# EAGLE design sbc6502 (EAGLE 6.5.0)
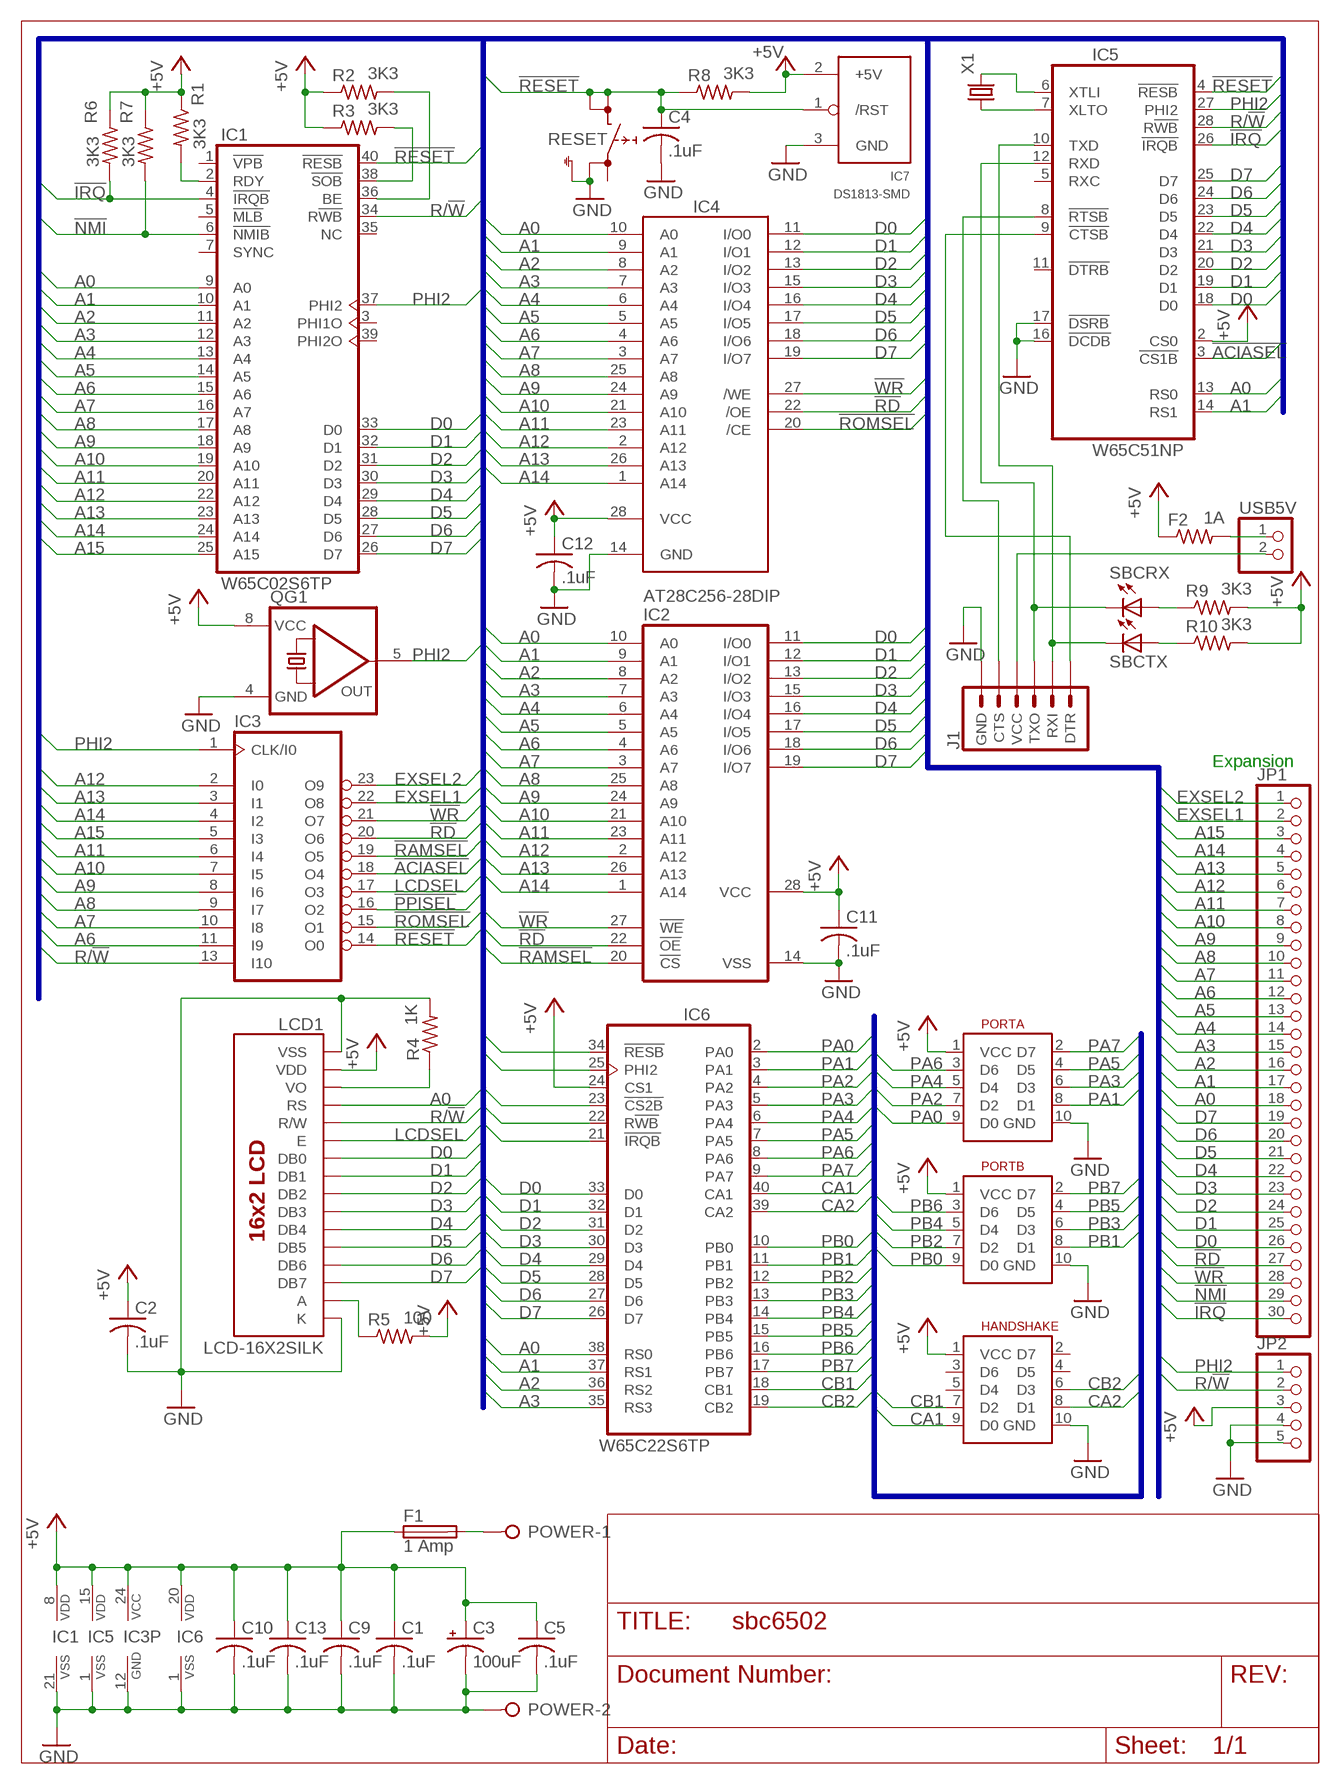
[diagram p0: schematic, sheet 1]

## Parts
C1  .1uF  C-USC0603K  [C0603K]
C2  .1uF  C-USC0603K  [C0603K]
C3  100uF  CPOL-USE5-8.5  [E5-8,5]
C4  .1uF  C-USC0603K  [C0603K]
C5  .1uF  C-USC0603K  [C0603K]
C9  .1uF  C-USC0603K  [C0603K]
C10  .1uF  C-USC0603K  [C0603K]
C11  .1uF  C-USC0603K  [C0603K]
C12  .1uF  C-USC0603K  [C0603K]
C13  .1uF  C-USC0603K  [C0603K]
F1  1 Amp  SH25  [SH25]
F2  1A  R-US_R0603  [R0603]
HANDSHAKE  8BIT_HEADER_SHROUDED  [2X05_SHROUDED]
IC1  W65C02S6TP  [DIL40]
IC2  62256P  [DIL28-6]
IC3  22V10  [DIL24-3]
IC4  AT28C256-28DIP  [DIL28-6]
IC5  W65C51NP  [DIL28-6]
IC6  W65C22S6TP  [DIL40]
IC7  DS1813-SMD  [SOT-23]
J1  6_PIN_SERIAL_TARGET  [1X06]
JP1  PINHD-1X30  [1X30]
JP2  PINHD-1X5  [1X05]
LCD1  LCD-16X2SILK  [LCD-16X2]
PORTA  8BIT_HEADER_SHROUDED  [2X05_SHROUDED]
PORTB  8BIT_HEADER_SHROUDED  [2X05_SHROUDED]
POWER  W237-02P  [W237-132]
QG1  QG5460  [DIL08S]
R1  3K3  R-US_R0603  [R0603]
R2  3K3  R-US_R0603  [R0603]
R3  3K3  R-US_R0603  [R0603]
R4  1K  R-US_R0603  [R0603]
R5  100  R-US_R0805  [R0805]
R6  3K3  R-US_R0603  [R0603]
R7  3K3  R-US_R0603  [R0603]
R8  3K3  R-US_R0603  [R0603]
R9  3K3  R-US_R0603  [R0603]
R10  3K3  R-US_R0603  [R0603]
RESET  SKHMPSE010  [SKHMPXE010]
SBCRX  LEDCHIPLED_0805  [CHIPLED_0805]
SBCTX  LEDCHIPLED_0805  [CHIPLED_0805]
USB5V  PINHD-1X2  [1X02]
X1  CRYSTALHC49U-V  [HC49U-V]

## Nets
!ACIASEL: IC3.18(O4) IC5.3(!CS1B)
!IRQ: IC1.4(1:!IRQB) IC5.26(!IRQB) IC6.21(VIA:!IRQB) JP1.30 R6.2
!NMI: IC1.6(1:!NMIB) JP1.29 R7.2
!PPISEL: IC3.16(O2) IC6.23(VIA:!CS2B)
!RAMSEL: IC2.20(!CS) IC3.19(O5)
!RD: IC2.22(!OE) IC3.20(O6) IC4.22(/OE) JP1.27
!RESET: C4.1 IC1.40(1:!RESB) IC3.14(O0) IC5.4(!RESB) IC6.34(VIA:!RESB) IC7.1(/RST) R8.1 RESET.3(2.1) RESET.4(2.2)
!ROMSEL: IC3.15(O1) IC4.20(/CE)
!WR: IC2.27(!WE) IC3.21(O7) IC4.27(/WE) JP1.28
+5V: C1.1 C2.1 C3.+ C5.1 C9.1 C10.1 C11.1 C12.1 C13.1 F1.1 F2.1 HANDSHAKE.1(VCC) IC1.8(P:VDD) IC2.28(VCC) IC3.24(VCC) IC4.28(VCC) IC5.2(CS0) IC5.15(VDD) IC6.20(VIAP:VDD) IC6.24(VIA:CS1) IC7.2(+5V) JP2.3 LCD1.2(VDD) PORTA.1(VCC) PORTB.1(VCC) QG1.8(VCC) R1.1 R2.1 R3.1 R5.2 R6.1 R7.1 R8.2 R9.2 R10.2
A0: IC1.9(1:A0) IC2.10(A0) IC4.10(A0) IC5.13(RS0) IC6.38(VIA:RS0) JP1.18 LCD1.4(RS)
A1: IC1.10(1:A1) IC2.9(A1) IC4.9(A1) IC5.14(RS1) IC6.37(VIA:RS1) JP1.17
A2: IC1.11(1:A2) IC2.8(A2) IC4.8(A2) IC6.36(VIA:RS2) JP1.16
A3: IC1.12(1:A3) IC2.7(A3) IC4.7(A3) IC6.35(VIA:RS3) JP1.15
A4: IC1.13(1:A4) IC2.6(A4) IC4.6(A4) JP1.14
A5: IC1.14(1:A5) IC2.5(A5) IC4.5(A5) JP1.13
A6: IC1.15(1:A6) IC2.4(A6) IC3.11(I9) IC4.4(A6) JP1.12
A7: IC1.16(1:A7) IC2.3(A7) IC3.10(I8) IC4.3(A7) JP1.11
A8: IC1.17(1:A8) IC2.25(A8) IC3.9(I7) IC4.25(A8) JP1.10
A9: IC1.18(1:A9) IC2.24(A9) IC3.8(I6) IC4.24(A9) JP1.9
A10: IC1.19(1:A10) IC2.21(A10) IC3.7(I5) IC4.21(A10) JP1.8
A11: IC1.20(1:A11) IC2.23(A11) IC3.6(I4) IC4.23(A11) JP1.7
A12: IC1.22(1:A12) IC2.2(A12) IC3.2(I0) IC4.2(A12) JP1.6
A13: IC1.23(1:A13) IC2.26(A13) IC3.3(I1) IC4.26(A13) JP1.5
A14: IC1.24(1:A14) IC2.1(A14) IC3.4(I2) IC4.1(A14) JP1.4
A15: IC1.25(1:A15) IC3.5(I3) JP1.3
CA1: HANDSHAKE.9(D0) IC6.40(VIA:CA1)
CA2: HANDSHAKE.8(D1) IC6.39(VIA:CA2)
CB1: HANDSHAKE.7(D2) IC6.18(VIA:CB1)
CB2: HANDSHAKE.6(D3) IC6.19(VIA:CB2)
D0: IC1.33(1:D0) IC2.11(I/O0) IC4.11(I/O0) IC5.18(D0) IC6.33(VIA:D0) JP1.26 LCD1.7(DB0)
D1: IC1.32(1:D1) IC2.12(I/O1) IC4.12(I/O1) IC5.19(D1) IC6.32(VIA:D1) JP1.25 LCD1.8(DB1)
D2: IC1.31(1:D2) IC2.13(I/O2) IC4.13(I/O2) IC5.20(D2) IC6.31(VIA:D2) JP1.24 LCD1.9(DB2)
D3: IC1.30(1:D3) IC2.15(I/O3) IC4.15(I/O3) IC5.21(D3) IC6.30(VIA:D3) JP1.23 LCD1.10(DB3)
D4: IC1.29(1:D4) IC2.16(I/O4) IC4.16(I/O4) IC5.22(D4) IC6.29(VIA:D4) JP1.22 LCD1.11(DB4)
D5: IC1.28(1:D5) IC2.17(I/O5) IC4.17(I/O5) IC5.23(D5) IC6.28(VIA:D5) JP1.21 LCD1.12(DB5)
D6: IC1.27(1:D6) IC2.18(I/O6) IC4.18(I/O6) IC5.24(D6) IC6.27(VIA:D6) JP1.20 LCD1.13(DB6)
D7: IC1.26(1:D7) IC2.19(I/O7) IC4.19(I/O7) IC5.25(D7) IC6.26(VIA:D7) JP1.19 LCD1.14(DB7)
EXSEL1: IC3.22(O8) JP1.2
EXSEL2: IC3.23(O9) JP1.1
GND: C1.2 C2.2 C3.- C4.2 C5.2 C9.2 C10.2 C11.2 C12.2 C13.2 HANDSHAKE.10(GND) IC1.21(P:VSS) IC2.14(VSS) IC3.12(GND) IC4.14(GND) IC5.1(VSS) IC5.16(!DCDB) IC5.17(!DSRB) IC6.1(VIAP:VSS) IC7.3(GND) J1.6(GND) JP2.4 JP2.5 LCD1.1(VSS) LCD1.16(K) PORTA.10(GND) PORTB.10(GND) POWER.2 QG1.4(GND) R4.2 RESET.2(1.2) RESET.5(SH)
LCDSEL: IC3.17(O3) LCD1.6(E)
N$1: LCD1.15(A) R5.1
N$2: LCD1.3(VO) R4.1
N$3: R9.1 SBCRX.A
N$4: R10.1 SBCTX.A
N$5: IC1.2(1:RDY) R1.2
N$6: IC1.38(1:!SOB) R3.2
N$7: IC1.36(1:BE) R2.2
N$11: IC5.7(XLTO) X1.1
N$12: IC5.6(XTLI) X1.2
N$15: J1.4(VCC) USB5V.2
N$16: F1.2 POWER.1
N$17: F2.2 USB5V.1
PA0: IC6.2(VIA:PA0) PORTA.9(D0)
PA1: IC6.3(VIA:PA1) PORTA.8(D1)
PA2: IC6.4(VIA:PA2) PORTA.7(D2)
PA3: IC6.5(VIA:PA3) PORTA.6(D3)
PA4: IC6.6(VIA:PA4) PORTA.5(D4)
PA5: IC6.7(VIA:PA5) PORTA.4(D5)
PA6: IC6.8(VIA:PA6) PORTA.3(D6)
PA7: IC6.9(VIA:PA7) PORTA.2(D7)
PB0: IC6.10(VIA:PB0) PORTB.9(D0)
PB1: IC6.11(VIA:PB1) PORTB.8(D1)
PB2: IC6.12(VIA:PB2) PORTB.7(D2)
PB3: IC6.13(VIA:PB3) PORTB.6(D3)
PB4: IC6.14(VIA:PB4) PORTB.5(D4)
PB5: IC6.15(VIA:PB5) PORTB.4(D5)
PB6: IC6.16(VIA:PB6) PORTB.3(D6)
PB7: IC6.17(VIA:PB7) PORTB.2(D7)
PHI2: IC1.37(1:PHI2) IC3.1(CLK/I0) IC5.27(PHI2) IC6.25(VIA:PHI2) JP2.1 QG1.5(OUT)
R/!W!: IC1.34(1:R!WB) IC3.13(I10) IC5.28(R!WB) IC6.22(VIA:R!WB) JP2.2 LCD1.5(R/W)
SBC_CTS: IC5.9(!CTSB) J1.1(DTR)
SBC_RTS: IC5.8(!RTSB) J1.5(CTS)
SBC_TX: IC5.10(TXD) J1.2(RXI) SBCTX.C
SBCRX: IC5.12(RXD) J1.3(TXO) SBCRX.C
Unconnected: HANDSHAKE.2(D7) HANDSHAKE.3(D6) HANDSHAKE.4(D5) HANDSHAKE.5(D4) IC1.1(1:!VPB) IC1.3(1:PHI1O) IC1.5(1:!MLB) IC1.7(1:SYNC) IC1.35(1:NC) IC1.39(1:PHI2O) IC5.5(RXC) IC5.11(!DTRB) RESET.1(1.1)

## Buses
BUS:D[0..7],A[0..15],PHI2,R/!W!,!RESET,!RAMSEL,!ROMSEL,!ACIASEL,!PPISEL,!IRQ,!NMI,!RD,!WR,LCDSEL,EXSEL1,EXSEL2
PPIBUS:PA[0..7],PB[0..7],CA1,CA2,CB1,CB2

## Notes on the sheet
- Expansion

## Library data of the parts
C1 C2 C4 C5 C9-C13 = rcl:C-US: CAPACITOR, American symbol
C3 = rcl:CPOL-US: POLARIZED CAPACITOR, American symbol
F1 = fuse:SH25: FUSE HOLDER grid 25 mm, OGN0031 8211, Schurter (Buerklin); MF: SCHURTER; MPN: 0031.8211; OC_FARNELL: 1162741; OC_NEWARK: 96B9380
F2 R1-R10 = rcl:R-US_: RESISTOR, American symbol
HANDSHAKE PORTA PORTB = LEDdynamics:8BIT_HEADER
IC1 = 6502:W65C02S: W65C02 by WDC
IC2 = memory-hitachi:62256P: MEMORY; OC_FARNELL: unknown; OC_NEWARK: unknown
IC3 = pal:22V10: PAL; MPN: GAL22V10D-7LPN; OC_FARNELL: 1571925; OC_NEWARK: 97M0480
IC4 = atmel-custom:AT28C256-28DIP: IC EEPROM 256KBIT 150NS 28DIP
IC5 = 6502:W65C51N: W65C51N by WDC
IC6 = 6502:W65C22S: W65C22 by WDC
IC7 = ds1813_revised:DS1813
J1 = SparkFun-Connectors:6_PIN_SERIAL_TARGET: 6-pin header connection for use with the "FTDI BASIC" pinout - TARGET SIDE. Also known as "Arduino Serial Program Header". It is used to mate with our FTDI Basic serial programmers using the Arduino IDE. Note, this device has "TARGET" in the name. It is intended to be used on a design that contains a target micro-controller that you wish to program. The "sister" device, named "CABLE" is inteneded to be used on a design that usually lives on the end of your USB cable and prvides the converter chip (FTDI232 or FTDI231x) to commnicate serial RX/TX. You can populate with some of these: Break Away Headers - Straight <https://www.sparkfun.com/products/116> (PRT-00116) For reference (or to suit your programming needs) check out these designs: SparkFun FTDI Basic Breakout - 5V <https://www.sparkfun.com/products/9716> (DEV-09716) SparkFun FTDI Basic Breakout - 3.3V <https://www.sparkfun.com/products/9873> (DEV-09873) SparkFun FTDI SmartBasic <https://www.sparkfun.com/products/12935> (DEV-12935) SparkFun Beefy 3 - FTDI Basic Breakout <https://www.sparkfun.com/products/13746> (DEV-13746)
JP1 = pinhead:PINHD-1X30: PIN HEADER
JP2 = pinhead:PINHD-1X5: PIN HEADER
LCD1 = SparkFun-Displays:LCD-16X2: Standard text-only 16x2 parallel input LCD Basic 16 character by 2 line display. Typically utilizes the extremely common HD44780 parallel interface chipset SparkFun Products: Basic 16x2 Green <https://www.sparkfun.com/products/255> Basic 8x2 Green <https://www.sparkfun.com/products/11122>; SF_ID: LCD-00255
POWER = con-wago-508:W237-02P: WAGO SREW CLAMP; OC_FARNELL: unknown; OC_NEWARK: unknown
QG1 = crystal:QG5460: CRYSTAL RESONATOR; OC_FARNELL: unknown; OC_NEWARK: unknown
RESET = switch:SKHMP*E010: 6.2 X 6.5mm TACT Switch (SMD) Source: http://www3.alps.co.jp/WebObjects/catalog.woa/PDF/E/Switch/Tact/SKHM/SKHM.PDF
SBCRX SBCTX = led:LED: LED OSRAM: - CHIPLED LG R971, LG N971, LY N971, LG Q971, LY Q971, LO R971, LY R971 LH N974, LH R974 LS Q976, LO Q976, LY Q976 LO Q996 - Hyper CHIPLED LW Q18S LB Q993, LB Q99A, LB R99A - SideLED LS A670, LO A670, LY A670, LG A670, LP A670 LB A673, LV A673, LT A673, LW A673 LH A674 LY A675 LS A676, LA A676, LO A676, LY A676, LW A676 LS A679, LY A679, LG A679 - Hyper Micro SIDELED® LS Y876, LA Y876, LO Y876, LY Y876 LT Y87S - SmartLED LW L88C, LW L88S LB L89C, LB L89S, LG L890 LS L89K, LO L89K, LY L89K LS L896, LA L896, LO L896, LY L896 - TOPLED LS T670, LO T670, LY T670, LG T670, LP T670 LSG T670, LSP T670, LSY T670, LOP T670, LYG T670 LG T671, LOG T671, LSG T671 LB T673, LV T673, LT T673, LW T673 LH T674 LS T676, LA T676, LO T676, LY T676, LB T676, LH T676, LSB T676, LW T676 LB T67C, LV T67C, LT T67C, LS T67K, LO T67K, LY T67K, LW E67C LS E67B, LA E67B, LO E67B, LY E67B, LB E67C, LV E67C, LT E67C LW T67C LS T679, LY T679, LG T679 LS T770, LO T770, LY T770, LG T770, LP T770 LB T773, LV T773, LT T773, LW T773 LH T774 LS E675, LA E675, LY E675, LS T675 LS T776, LA T776, LO T776, LY T776, LB T776 LHGB T686 LT T68C, LB T68C - Hyper Mini TOPLED® LB M676 - Mini TOPLED Santana® LG M470 LS M47K, LO M47K, LY M47K Source: http://www.osram.convergy.de LUXEON: - LUMILED® LXK2-PW12-R00, LXK2-PW12-S00, LXK2-PW14-U00, LXK2-PW14-V00 LXK2-PM12-R00, LXK2-PM12-S00, LXK2-PM14-U00 LXK2-PE12-Q00, LXK2-PE12-R00, LXK2-PE12-S00, LXK2-PE14-T00, LXK2-PE14-U00 LXK2-PB12-K00, LXK2-PB12-L00, LXK2-PB12-M00, LXK2-PB14-N00, LXK2-PB14-P00, LXK2-PB14-Q00 LXK2-PR12-L00, LXK2-PR12-M00, LXK2-PR14-Q00, LXK2-PR14-R00 LXK2-PD12-Q00, LXK2-PD12-R00, LXK2-PD12-S00 LXK2-PH12-R00, LXK2-PH12-S00 LXK2-PL12-P00, LXK2-PL12-Q00, LXK2-PL12-R00 Source: www.luxeon.com KINGBRIGHT: KA-3528ASYC Source: www.kingbright.com
USB5V = pinhead:PINHD-1X2: PIN HEADER
X1 = crystal:CRYSTAL: CRYSTAL; OC_FARNELL: 1666969; OC_NEWARK: unknown

## Board
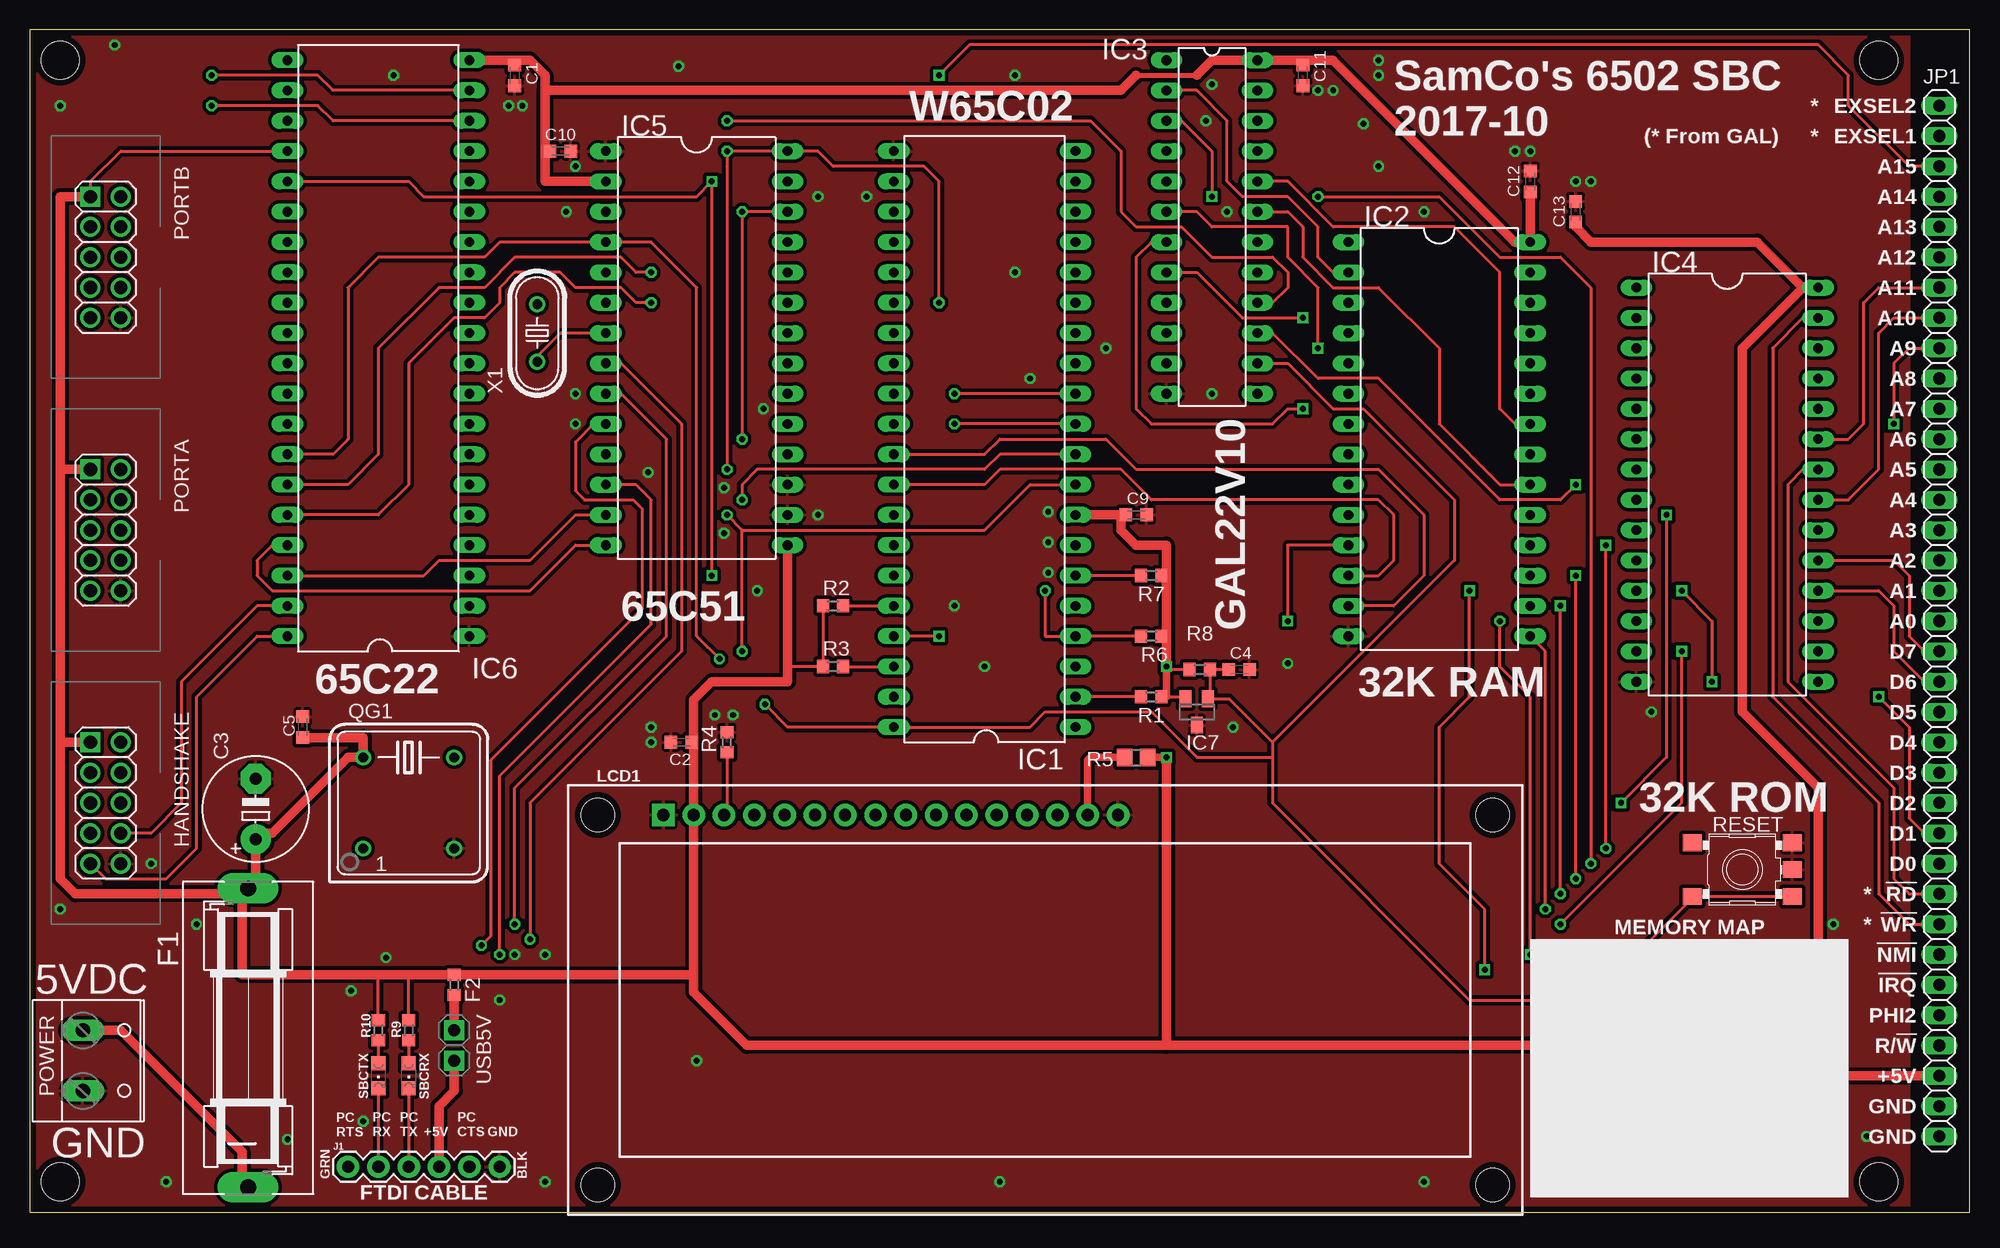
[diagram p1: board, top side]
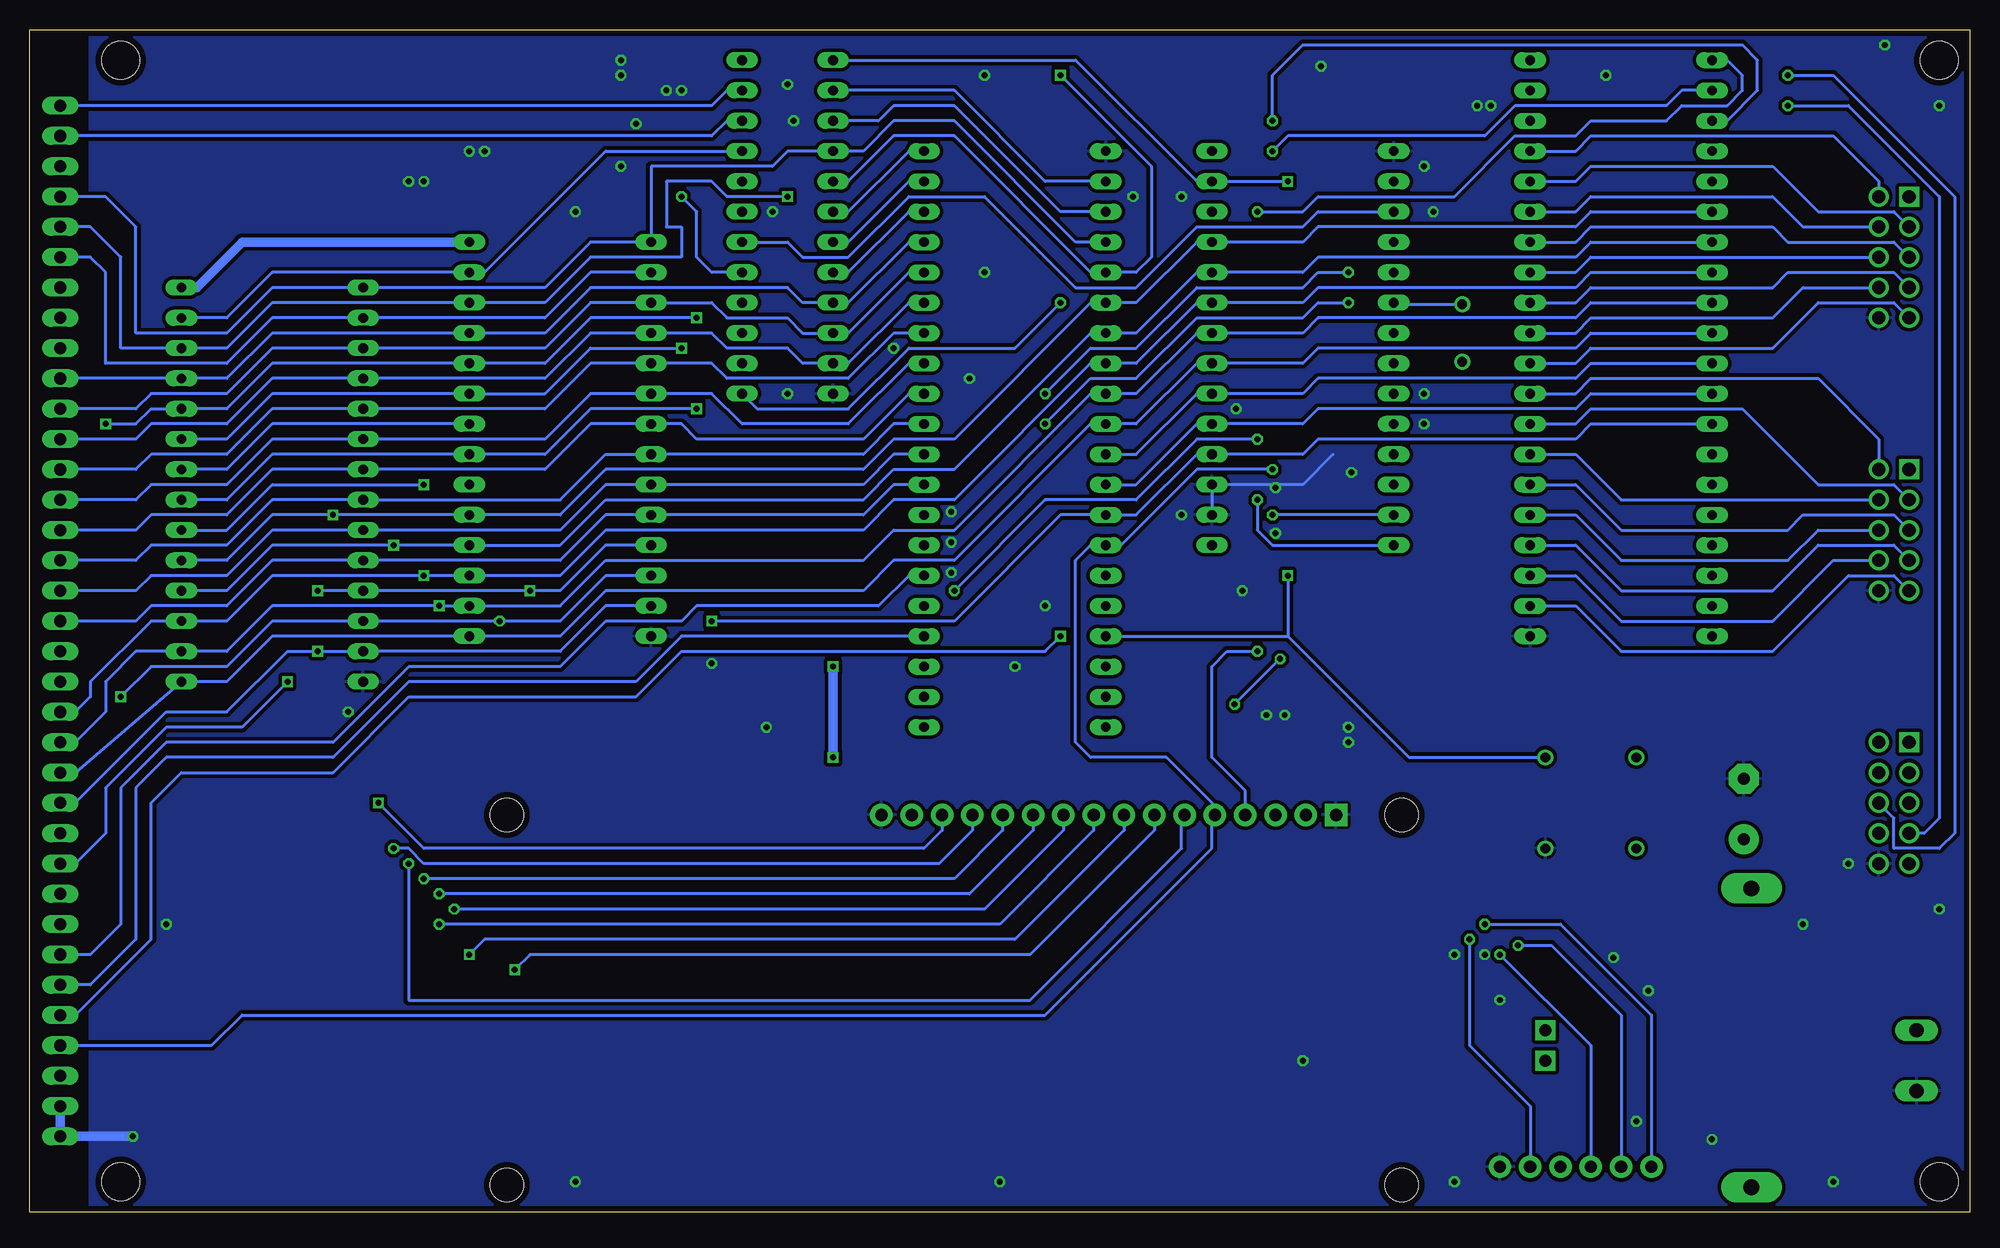
[diagram p2: board, bottom side, seen from below]

Size 162.56 x 99.06 mm. Coordinates in mm from the lower left corner, seen from the top.
Outline: 0,0 162.56,0 162.56,99.06 0,99.06 0,0
Copper layers (1*16): Top 0.035mm / dielectric 1.5mm / Bottom 0.035mm
Design rules "default *": minimum track width 10mil, minimum drill 19mil, track to track 8mil, track to pad 8mil, pad to pad 8mil, via to via 8mil, smd to smd 8mil, copper to edge 20mil, drill to drill 8mil, minimum pad ring 10mil, minimum via ring 8mil, stop-mask expansion 4mil, vias tented up to drill 20mil, thermal gap 10mil
Holes 3.17 mm at 2.54,2.54 154.94,2.54 154.94,96.52 2.54,96.52

### Footprints (pad centres in the part's own frame; a part is rotated, then mirrored left to right if it is on the bottom)
C0603K = smd 1.05 x 1.08: 1 -0.875,0; 2 0.875,0
E5-8,5 = drill 1.016 pad 2.54: + -2.54,0 | drill 1.016 pad 2.54 octagon: - 2.54,0
SH25 = drill 1.321 pad 2.54 long: 1 -12.522,0; 2 12.522,0
R0603 = smd 1 x 1.1: 1 -0.85,0; 2 0.85,0
2X05_SHROUDED = drill 1.1 pad 1.676 square: 1 -5.08,-1.27 | drill 1.1 pad 1.676: 2 -5.08,1.27; 3 -2.54,-1.27; 4 -2.54,1.27; 5 0,-1.27; 6 0,1.27; 7 2.54,-1.27; 8 2.54,1.27; 9 5.08,-1.27; 10 5.08,1.27
DIL40 = drill 0.813 long: 1 -24.13,-7.62; 2 -21.59,-7.62; 3 -19.05,-7.62; 4 -16.51,-7.62; 5 -13.97,-7.62; 6 -11.43,-7.62; 7 -8.89,-7.62; 8 -6.35,-7.62; 9 -3.81,-7.62; 10 -1.27,-7.62; 11 1.27,-7.62; 12 3.81,-7.62; 13 6.35,-7.62; 14 8.89,-7.62; 15 11.43,-7.62; 16 13.97,-7.62; 17 16.51,-7.62; 18 19.05,-7.62; 19 21.59,-7.62; 20 24.13,-7.62; 21 24.13,7.62; 22 21.59,7.62; 23 19.05,7.62; 24 16.51,7.62; 25 13.97,7.62; 26 11.43,7.62; 27 8.89,7.62; 28 6.35,7.62; 29 3.81,7.62; 30 1.27,7.62; 31 -1.27,7.62; 32 -3.81,7.62; 33 -6.35,7.62; 34 -8.89,7.62; 35 -11.43,7.62; 36 -13.97,7.62; 37 -16.51,7.62; 38 -19.05,7.62; 39 -21.59,7.62; 40 -24.13,7.62
DIL28-6 = drill 0.813 long: 1 -16.51,-7.62; 2 -13.97,-7.62; 3 -11.43,-7.62; 4 -8.89,-7.62; 5 -6.35,-7.62; 6 -3.81,-7.62; 7 -1.27,-7.62; 8 1.27,-7.62; 9 3.81,-7.62; 10 6.35,-7.62; 11 8.89,-7.62; 12 11.43,-7.62; 13 13.97,-7.62; 14 16.51,-7.62; 15 16.51,7.62; 16 13.97,7.62; 17 11.43,7.62; 18 8.89,7.62; 19 6.35,7.62; 20 3.81,7.62; 21 1.27,7.62; 22 -1.27,7.62; 23 -3.81,7.62; 24 -6.35,7.62; 25 -8.89,7.62; 26 -11.43,7.62; 27 -13.97,7.62; 28 -16.51,7.62
DIL24-3 = drill 0.813 long: 1 -13.97,-3.81; 2 -11.43,-3.81; 3 -8.89,-3.81; 4 -6.35,-3.81; 5 -3.81,-3.81; 6 -1.27,-3.81; 7 1.27,-3.81; 8 3.81,-3.81; 9 6.35,-3.81; 10 8.89,-3.81; 11 11.43,-3.81; 12 13.97,-3.81; 13 13.97,3.81; 14 11.43,3.81; 15 8.89,3.81; 16 6.35,3.81; 17 3.81,3.81; 18 1.27,3.81; 19 -1.27,3.81; 20 -3.81,3.81; 21 -6.35,3.81; 22 -8.89,3.81; 23 -11.43,3.81; 24 -13.97,3.81
SOT-23 = smd 1 x 1.4: 1 -0.95,-1.1; 2 0.95,-1.1; 3 0,1.1
1X06 = drill 1.016 pad 1.88: 1 0,0; 2 2.54,0; 3 5.08,0; 4 7.62,0; 5 10.16,0; 6 12.7,0
1X30 = drill 1.016 long: 1 -36.83,0; 2 -34.29,0; 3 -31.75,0; 4 -29.21,0; 5 -26.67,0; 6 -24.13,0; 7 -21.59,0; 8 -19.05,0; 9 -16.51,0; 10 -13.97,0; 11 -11.43,0; 12 -8.89,0; 13 -6.35,0; 14 -3.81,0; 15 -1.27,0; 16 1.27,0; 17 3.81,0; 18 6.35,0; 19 8.89,0; 20 11.43,0; 21 13.97,0; 22 16.51,0; 23 19.05,0; 24 21.59,0; 25 24.13,0; 26 26.67,0; 27 29.21,0; 28 31.75,0; 29 34.29,0; 30 36.83,0
1X05 = drill 1.016 long: 1 -5.08,0; 2 -2.54,0; 3 0,0; 4 2.54,0; 5 5.08,0
LCD-16X2 = drill 1.016 pad 1.88 square: 1 -32,15.5 | drill 1.016 pad 1.88: 2 -29.46,15.5; 3 -26.92,15.5; 4 -24.38,15.5; 5 -21.84,15.5; 6 -19.3,15.5; 7 -16.76,15.5; 8 -14.22,15.5; 9 -11.68,15.5; 10 -9.14,15.5; 11 -6.6,15.5; 12 -4.06,15.5; 13 -1.52,15.5; 14 1.02,15.5; 15 3.56,15.5; 16 6.1,15.5 | hole 2.8: -37.5,15.5; -37.5,-15.5; 37.5,15.5; 37.5,-15.5
W237-132 = drill 1.194 long: 1 -2.54,-0.635; 2 2.54,-0.635
DIL08S = drill 0.813: 1 -3.81,-3.81; 4 3.81,-3.81; 5 3.81,3.81; 8 -3.81,3.81
R0805 = smd 1.3 x 1.5: 1 -0.95,0; 2 0.95,0
SKHMPXE010 = smd 1.6 x 1.4: 1 -4.2,2.25; 2 4.2,2.25; 3 -4.2,-2.25; 4 4.2,-2.25; 5 4.2,0
CHIPLED_0805 = smd 1.2 x 1.2: A 0,-1.05; C 0,1.05
1X02 = drill 1.016 pad 1.676 square: 1 -1.27,0; 2 1.27,0
HC49U-V = drill 0.813: 1 -2.413,0; 2 2.413,0

### Placement (x,y rotation side)
C1  40.64,95.25 270 top
C2  54.61,39.37 180 top
C3  18.92,33.78 90 top
C4  101.35,45.47 0 top
C5  22.86,40.64 90 top
C9  92.71,58.42 0 top
C10  44.45,88.9 0 top
C11  106.68,95.25 270 top
C12  125.73,86.36 90 top
C13  129.54,83.82 90 top
F1  18.29,14.61 270 top
F2  35.56,19.05 270 top
HANDSHAKE  6.35,34.29 270 top
IC1  80.01,64.77 90 top
IC2  118.11,64.77 270 top
IC3  99.06,82.55 270 top
IC4  142.24,60.96 270 top
IC5  55.88,72.39 270 top
IC6  29.21,72.39 90 top
IC7  97.79,41.91 180 top
J1  26.67,3.81 0 top
JP1  160.02,55.88 270 top
JP2  160.02,11.43 270 top
LCD1  85.09,17.78 0 top
PORTA  6.35,57.15 270 top
PORTB  6.35,80.01 270 top
POWER  5.08,12.7 270 top
QG1  31.75,34.29 0 top
R1  93.98,43.18 180 top
R2  67.31,50.8 0 top
R3  67.31,45.72 0 top
R4  58.42,39.37 90 top
R5  92.71,38.1 0 top
R6  93.98,48.26 180 top
R7  93.98,53.34 180 top
R8  98.04,45.47 180 top
R9  31.75,15.24 90 top
R10  29.21,15.24 90 top
RESET  143.51,28.7 0 top
SBCRX  31.75,11.43 180 top
SBCTX  29.21,11.43 180 top
USB5V  35.56,13.97 270 top
X1  42.52,73.66 90 top

### Tracks (layer width: path | path; a pad name or v marks a point on that pad's centre or on a via)
!ACIASEL
  Bottom 0.254: IC3.18 99.06,81.28 97.79,80.01 93.98,80.01 88.9,85.09 82.55,85.09 74.93,77.47 69.85,77.47 64.77,82.55 55.88,82.55 54.61,83.82 IC5.3
!IRQ  (via drill 0.5)
  Top 0.254: IC5.26 v59.69,83.82 v59.69,64.77 | v85.09,52.07 85.09,48.26 IC1.4 R6.2
  Bottom 0.254: v59.69,64.77 64.77,64.77 69.85,59.69 77.47,59.69 v85.09,52.07 | IC1.4 107.95,48.26 111.76,44.45 130.81,44.45 137.16,38.1 151.13,38.1 153.67,35.56 153.67,22.86 157.48,19.05 JP1.30 | v59.69,83.82 55.88,83.82 54.61,85.09 43.18,85.09 38.1,90.17 33.02,90.17 31.75,91.44 25.4,91.44 24.13,92.71 20.32,92.71 19.05,93.98 19.05,95.25 20.32,96.52 IC6.21
!NMI
  Top 0.254: R7.2 IC1.6
  Bottom 0.254: IC1.6 88.9,53.34 91.44,50.8 106.68,50.8 107.95,49.53 114.3,49.53 118.11,45.72 130.81,45.72 137.16,39.37 151.13,39.37 154.94,35.56 154.94,24.13 157.48,21.59 JP1.29
!PPISEL  (via drill 0.5)
  Top 0.254: v58.42,91.44 88.9,91.44 91.44,88.9 91.44,83.82 92.71,82.55 96.52,82.55 99.06,80.01 104.14,80.01 105.41,78.74 105.41,77.47 104.14,76.2 IC3.16
  Bottom 0.254: IC6.23 20.32,91.44 17.78,93.98 17.78,96.52 19.05,97.79 55.88,97.79 58.42,95.25 v58.42,91.44
!RAMSEL
  Top 0.254: IC3.19 105.41,83.82 106.68,82.55 106.68,80.01 109.22,77.47 113.03,77.47 118.11,72.39 118.11,66.04 123.19,60.96 IC2.20
!RD
  Top 0.254: IC2.22 124.46,66.04 123.19,67.31 123.19,78.74 119.38,82.55 109.22,82.55 105.41,86.36 IC3.20 | IC4.22 148.59,62.23 147.32,60.96 147.32,44.45 156.21,35.56 156.21,27.94 157.48,26.67 JP1.27
  Bottom 0.254: IC2.22 142.24,66.04 146.05,62.23 IC4.22
!RESET  (via drill 0.5)
  Top 0.254: 104.14,39.37 100.5,43.01 IC7.1 98.89,43.16 R8.1 C4.1 | 104.14,39.37 104.14,38.1 | 104.14,38.1 104.14,34.29 120.65,17.78 130.81,17.78 139.45,26.42 139.56,26.42 RESET.3 | 104.14,38.1 97.79,38.1 93.98,41.91 85.09,41.91 83.82,40.64 IC1.40 63.5,40.64 v61.59,42.55 | IC3.14 105.41,71.12 109.22,67.31 111.76,67.31 119.38,59.69 119.38,54.61 104.14,39.37 | RESET.3 RESET.4 | 139.19,26.33 RESET.3 | v57.78,46.35 55.88,48.26 55.88,77.47 52.07,81.28 IC5.4 39.37,81.28 38.1,80.01 29.21,80.01 26.67,77.47 26.67,64.77 25.4,63.5 IC6.34
  Bottom 0.254: v57.78,46.35 v61.59,42.55
!ROMSEL  (via drill 0.5)
  Top 0.254: v129.54,60.96 128.27,59.69 123.19,59.69 113.03,69.85 107.95,69.85 104.14,73.66 IC3.15
  Bottom 0.254: IC4.20 146.05,57.15 142.24,60.96 v129.54,60.96
!WR
  Top 0.254: IC4.27 148.59,74.93 146.05,72.39 146.05,43.18 154.94,34.29 154.94,26.67 157.48,24.13 JP1.28
  Bottom 0.254: IC4.27 146.05,74.93 142.24,78.74 IC2.27 124.46,78.74 114.3,88.9 IC3.21
+5V  (via drill 0.5)
  Top 0.254: R1.1 96.67,43.18 IC7.2 | R2.1 R3.1 63.5,45.72 63.5,44.45 | C9.1 91.44,58.42 | R7.1 95.25,53.34 | R6.1 95.25,48.26 | R8.2 95.5,45.47 v95.25,45.72 | R10.2 29.21,19.9 | R9.2 31.75,19.9 | PORTB.1 5.08,86.36 7.62,88.9 IC6.24
  Top 0.305: C10.1 43.18,88.9
  Top 0.406: 92.71,95.25 97.79,95.25
  Top 0.61: R5.2 v95.25,38.1 | v95.25,45.72 95.25,43.17 R1.1
  Top 0.813: 17.78,26.67 17.83,26.67 F1.1 18.92,27.76 C3.+ 19.43,31.75 20.32,31.75 26.67,38.1 QG1.8 27.94,39.77 C5.1 | 17.78,26.67 3.81,26.67 2.54,27.94 2.54,39.37 | PORTB.1 2.54,85.09 2.54,62.23 | 2.54,62.23 2.54,39.37 | IC5.2 43.18,86.36 43.18,88.9 43.18,93.98 | 43.18,93.98 43.18,95.25 41.91,96.52 40.64,96.52 | 43.18,93.98 91.44,93.98 92.71,95.25 | 97.79,95.25 99.06,96.52 IC3.24 106.28,96.52 | 55.63,19.9 LCD1.2 55.63,39.37 | 55.63,19.9 55.63,18.8 55.63,18.41 60.07,13.97 95.25,13.97 | IC4.28 148.59,77.47 | 148.59,77.47 143.51,72.39 143.51,41.91 149.86,35.56 149.86,19.05 144.78,13.97 | 144.78,13.97 95.25,13.97 | 106.28,96.52 109.22,96.52 124.46,81.28 IC2.28 C12.1 | 106.28,96.52 C11.1 | IC1.8 91.44,58.42 91.44,57.15 92.71,55.88 95.25,55.88 95.25,53.34 95.25,48.26 v95.25,45.72 | v95.25,38.1 95.25,13.97 | IC5.15 63.5,44.45 57.15,44.45 55.63,42.93 55.63,39.62 55.63,39.37 | C2.1 55.63,39.37 | 144.78,13.97 147.32,11.43 JP2.3 | C13.1 129.54,82.55 130.81,81.28 144.78,81.28 148.59,77.47 | 55.63,19.9 F2.1 31.75,19.9 29.21,19.9 17.78,19.9 17.78,26.67 | 40.64,96.52 IC6.20 | C1.1 40.64,96.52 | PORTA.1 2.54,62.23 | HANDSHAKE.1 2.54,39.37
  Bottom 0.813: IC2.28 144.78,81.28 148.59,77.47 IC4.28 | v95.25,45.72 v95.25,38.1
A0  (via drill 0.5)
  Top 0.254: v58.42,58.42 59.69,57.15 | 59.69,57.15 80.01,57.15 83.82,60.96 IC1.9 | v59.69,46.99 59.69,57.15 | IC6.38 33.02,53.34 34.29,54.61 41.91,54.61 45.72,58.42 IC5.13
  Bottom 0.254: IC1.9 90.17,60.96 92.71,58.42 IC2.10 114.3,58.42 118.11,54.61 IC4.10 142.24,54.61 146.05,50.8 152.4,50.8 153.67,49.53 JP1.18 | IC5.13 v58.42,58.42 | LCD1.4 60.71,35.31 63.5,38.1 63.5,45.72 62.23,46.99 v59.69,46.99
A1  (via drill 0.5)
  Top 0.254: IC1.10 81.28,63.5 80.01,62.23 60.96,62.23 59.69,60.96 v59.69,59.69 | IC6.37 20.32,55.88 19.05,54.61 19.05,53.34 20.32,52.07 41.91,52.07 45.72,55.88 IC5.14
  Bottom 0.254: IC1.10 90.17,63.5 92.71,60.96 IC2.9 114.3,60.96 118.11,57.15 IC4.9 142.24,57.15 146.05,53.34 152.4,53.34 153.67,52.07 JP1.17 | v59.69,59.69 59.69,57.15 58.42,55.88 IC5.14
A2  (via drill 0.5)
  Top 0.254: IC1.11 v77.47,66.04 | v52.07,76.2 50.8,76.2 49.53,77.47 45.72,77.47 44.45,78.74 40.64,78.74 39.37,77.47 39.37,76.2 38.1,74.93 35.56,74.93 31.75,71.12 31.75,60.96 29.21,58.42 IC6.36
  Bottom 0.254: IC1.11 90.17,66.04 92.71,63.5 IC2.8 114.3,63.5 118.11,59.69 IC4.8 142.24,59.69 146.05,55.88 152.4,55.88 153.67,54.61 JP1.16 | v77.47,66.04 73.66,69.85 69.85,69.85 64.77,74.93 55.88,74.93 54.61,76.2 v52.07,76.2
A3  (via drill 0.5)
  Top 0.254: IC1.12 v77.47,68.58 | v52.07,78.74 50.8,78.74 49.53,80.01 40.64,80.01 38.1,77.47 34.29,77.47 29.21,72.39 29.21,63.5 26.67,60.96 IC6.35
  Bottom 0.254: IC1.12 88.9,68.58 92.71,64.77 106.68,64.77 107.95,66.04 IC2.7 115.57,66.04 119.38,62.23 IC4.7 142.24,62.23 146.05,58.42 152.4,58.42 153.67,57.15 JP1.15 | v77.47,68.58 73.66,72.39 69.85,72.39 64.77,77.47 55.88,77.47 54.61,78.74 v52.07,78.74
A4
  Bottom 0.254: IC1.13 88.9,71.12 93.98,66.04 102.87,66.04 105.41,68.58 IC2.6 115.57,68.58 119.38,64.77 IC4.6 142.24,64.77 146.05,60.96 152.4,60.96 153.67,59.69 JP1.14
A5
  Bottom 0.254: IC1.14 90.17,73.66 93.98,69.85 104.14,69.85 105.41,71.12 IC2.5 115.57,71.12 119.38,67.31 IC4.5 142.24,67.31 146.05,63.5 152.4,63.5 153.67,62.23 JP1.13
A6
  Bottom 0.254: IC1.15 88.9,76.2 93.98,71.12 IC3.11 97.79,71.12 99.06,72.39 104.14,72.39 105.41,73.66 IC2.4 115.57,73.66 119.38,69.85 IC4.4 142.24,69.85 146.05,66.04 152.4,66.04 153.67,64.77 JP1.12
A7
  Bottom 0.254: IC1.16 88.9,78.74 93.98,73.66 IC3.10 97.79,73.66 99.06,74.93 104.14,74.93 105.41,76.2 IC2.3 115.57,76.2 119.38,72.39 IC4.3 142.24,72.39 146.05,68.58 152.4,68.58 153.67,67.31 JP1.11
A8
  Bottom 0.254: IC1.17 88.9,81.28 93.98,76.2 IC3.9 97.79,76.2 99.06,77.47 115.57,77.47 119.38,73.66 IC2.25 142.24,73.66 146.05,69.85 IC4.25 JP1.10
A9  (via drill 0.5)
  Top 0.254: IC3.8 97.79,78.74 101.6,74.93 v106.68,74.93 | JP1.9 157.48,72.39 156.21,71.12 v156.21,66.04
  Bottom 0.254: IC3.8 93.98,78.74 88.9,83.82 IC1.18 | v106.68,74.93 115.57,74.93 119.38,71.12 IC2.24 142.24,71.12 146.05,67.31 IC4.24 152.4,67.31 153.67,66.04 v156.21,66.04
A10  (via drill 0.5)
  Top 0.254: IC3.7 93.98,81.28 92.71,80.01 92.71,67.31 93.98,66.04 104.14,66.04 105.41,67.31 v106.68,67.31 | IC4.21 152.4,59.69 154.94,62.23 154.94,73.66 156.21,74.93 JP1.8
  Bottom 0.254: IC3.7 93.98,81.28 88.9,86.36 IC1.19 | IC4.21 146.05,59.69 142.24,63.5 IC2.21 119.38,63.5 115.57,67.31 v106.68,67.31
A11  (via drill 0.5)
  Top 0.254: v107.95,72.39 107.95,77.47 105.41,80.01 105.41,82.55 99.06,82.55 97.79,83.82 IC3.6 | IC4.23 152.4,64.77 153.67,66.04 153.67,76.2 154.94,77.47 JP1.7
  Bottom 0.254: IC3.6 93.98,83.82 88.9,88.9 IC1.20 | IC4.23 146.05,64.77 142.24,68.58 IC2.23 119.38,68.58 115.57,72.39 v107.95,72.39
A12
  Top 0.254: IC2.2 109.22,78.74 107.95,80.01 107.95,82.55 105.41,85.09 101.6,85.09 100.33,86.36 100.33,91.44 97.79,93.98 IC3.2
  Bottom 0.254: IC1.22 77.47,86.36 85.09,93.98 IC3.2 | IC2.2 115.57,78.74 119.38,74.93 IC4.2 142.24,74.93 146.05,71.12 156.21,71.12 156.21,78.74 157.48,80.01 JP1.6
A13  (via drill 0.5)
  Top 0.254: IC3.3 96.52,91.44 99.06,88.9 v99.06,85.09
  Bottom 0.254: IC1.23 76.2,83.82 85.09,92.71 90.17,92.71 91.44,91.44 IC3.3 | v99.06,85.09 104.14,85.09 105.41,86.36 109.22,86.36 109.22,82.55 107.95,82.55 107.95,80.01 115.57,80.01 119.38,76.2 IC2.26 142.24,76.2 146.05,72.39 IC4.26 154.94,72.39 154.94,80.01 157.48,82.55 JP1.5
A14
  Bottom 0.254: IC1.24 74.93,81.28 85.09,91.44 90.17,91.44 92.71,88.9 IC3.4 99.06,88.9 100.33,87.63 110.49,87.63 IC2.1 115.57,81.28 119.38,77.47 IC4.1 142.24,77.47 146.05,73.66 153.67,73.66 153.67,82.55 156.21,85.09 JP1.4
A15  (via drill 0.5)
  Top 0.254: JP1.3 157.48,87.63 152.4,92.71 152.4,95.25 149.86,97.79 78.74,97.79 v76.2,95.25
  Bottom 0.254: IC3.5 93.98,86.36 90.17,90.17 85.09,90.17 73.66,78.74 IC1.25 69.85,78.74 68.58,80.01 68.58,87.63 v76.2,95.25
CA1
  Top 0.254: HANDSHAKE.9 6.35,27.94 11.43,27.94 13.97,30.48 13.97,43.18 19.05,48.26 IC6.40
CA2
  Top 0.254: IC6.39 19.05,50.8 12.7,44.45 12.7,34.29 10.16,31.75 HANDSHAKE.8
CB1  (via drill 0.5)
  Top 0.254: IC6.18 25.4,91.44 24.13,92.71 v15.24,92.71
  Bottom 0.254: v15.24,92.71 10.16,92.71 2.54,85.09 2.54,33.02 3.81,31.75 HANDSHAKE.7
CB2  (via drill 0.5)
  Top 0.254: IC6.19 25.4,93.98 24.13,95.25 v15.24,95.25
  Bottom 0.254: v15.24,95.25 11.43,95.25 1.27,85.09 1.27,31.75 2.54,30.48 6.35,30.48 6.35,33.02 HANDSHAKE.6
D0  (via drill 0.5)
  Top 0.254: IC2.11 105.41,55.88 v105.41,49.53 | v121.92,20.32 121.92,25.4 118.11,29.21 118.11,40.64 120.65,43.18 v120.65,52.07 | v138.43,52.07 140.97,49.53 v140.97,44.45
  Bottom 0.254: IC2.11 114.3,55.88 118.11,52.07 v120.65,52.07 IC4.11 v138.43,52.07 | v105.41,49.53 85.09,49.53 76.2,58.42 IC1.33 69.85,58.42 64.77,63.5 IC5.18 55.88,63.5 54.61,64.77 33.02,64.77 31.75,66.04 IC6.33 | LCD1.7 68.33,32 78.74,21.59 120.65,21.59 v121.92,20.32 | v140.97,44.45 144.78,40.64 151.13,40.64 156.21,35.56 156.21,31.75 158.75,29.21 JP1.26
D1  (via drill 0.5)
  Top 0.254: IC2.12 113.03,53.34 114.3,54.61 114.3,58.42 113.03,59.69 93.98,59.69 91.44,62.23 81.28,62.23 80.01,60.96 IC1.32 | v125.73,21.59 125.73,43.18 123.19,45.72 v123.19,49.53 | v154.94,43.18 157.48,40.64 157.48,33.02 158.75,31.75 JP1.25
  Bottom 0.254: IC2.12 114.3,53.34 118.11,49.53 v123.19,49.53 IC4.12 142.24,49.53 146.05,45.72 152.4,45.72 v154.94,43.18 | IC1.32 69.85,60.96 64.77,66.04 IC5.19 55.88,66.04 54.61,67.31 33.02,67.31 31.75,68.58 IC6.32 | LCD1.8 70.87,32 80.01,22.86 124.46,22.86 v125.73,21.59
D2  (via drill 0.5)
  Top 0.254: IC1.31 80.01,63.5 81.28,64.77 90.17,64.77 92.71,62.23 113.03,62.23 116.84,58.42 116.84,53.34 114.3,50.8 IC2.13 | v128.27,24.13 138.43,34.29 v138.43,46.99
  Bottom 0.254: IC2.13 114.3,50.8 118.11,46.99 IC4.13 v138.43,46.99 140.97,46.99 146.05,41.91 151.13,41.91 158.75,34.29 JP1.24 | IC1.31 69.85,63.5 64.77,68.58 IC5.20 55.88,68.58 54.61,69.85 33.02,69.85 31.75,71.12 IC6.31 | LCD1.9 73.41,32 81.28,24.13 v128.27,24.13
D3  (via drill 0.5)
  Top 0.254: v127,25.4 127,46.99 IC2.15
  Bottom 0.254: LCD1.10 75.95,32 82.55,25.4 v127,25.4 | JP1.23 158.75,36.83 IC4.15 146.05,44.45 142.24,48.26 IC2.15 118.11,48.26 114.3,52.07 92.71,52.07 90.17,54.61 85.09,54.61 73.66,66.04 IC1.30 69.85,66.04 64.77,71.12 IC5.21 55.88,71.12 54.61,72.39 33.02,72.39 31.75,73.66 IC6.30
D4  (via drill 0.5)
  Top 0.254: v128.27,26.67 v128.27,50.8
  Bottom 0.254: LCD1.11 78.49,32 83.82,26.67 v128.27,26.67 | JP1.22 158.75,39.37 156.21,41.91 156.21,44.45 153.67,46.99 IC4.16 146.05,46.99 142.24,50.8 v128.27,50.8 IC2.16 118.11,50.8 114.3,54.61 92.71,54.61 90.17,57.15 85.09,57.15 73.66,68.58 IC1.29 69.85,68.58 64.77,73.66 IC5.22 55.88,73.66 54.61,74.93 33.02,74.93 31.75,76.2 IC6.29
D5  (via drill 0.5)
  Top 0.254: v129.54,27.94 v129.54,53.34
  Bottom 0.254: LCD1.12 81.03,32 85.09,27.94 v129.54,27.94 | JP1.21 158.75,41.91 157.48,43.18 157.48,44.45 152.4,49.53 IC4.17 146.05,49.53 142.24,53.34 v129.54,53.34 IC2.17 118.11,53.34 114.3,57.15 92.71,57.15 90.17,59.69 85.09,59.69 73.66,71.12 IC1.28 69.85,71.12 64.77,76.2 IC5.23 55.88,76.2 54.61,77.47 33.02,77.47 31.75,78.74 IC6.28
D6  (via drill 0.5)
  Top 0.254: v132.08,30.48 v132.08,55.88 | IC4.18 154.94,52.07 156.21,50.8 156.21,46.99 158.75,44.45 JP1.20
  Bottom 0.254: IC4.18 146.05,52.07 142.24,55.88 v132.08,55.88 IC2.18 118.11,55.88 114.3,59.69 92.71,59.69 90.17,62.23 85.09,62.23 73.66,73.66 IC1.27 69.85,73.66 64.77,78.74 IC5.24 55.88,78.74 54.61,80.01 33.02,80.01 31.75,81.28 IC6.27 | LCD1.13 83.57,32 86.36,29.21 129.54,29.21 130.81,30.48 v132.08,30.48
D7  (via drill 0.5)
  Top 0.254: IC4.19 156.21,54.61 157.48,53.34 157.48,48.26 158.75,46.99 JP1.19 | v137.16,58.42 137.16,38.1 v133.35,34.29
  Bottom 0.254: IC4.19 146.05,54.61 142.24,58.42 v137.16,58.42 IC2.19 118.11,58.42 114.3,62.23 92.71,62.23 90.17,64.77 85.09,64.77 73.66,76.2 IC1.26 69.85,76.2 64.77,81.28 IC5.25 55.88,81.28 54.61,82.55 33.02,82.55 31.75,83.82 IC6.26 | LCD1.14 86.11,32 87.63,30.48 129.54,30.48 v133.35,34.29
EXSEL1
  Bottom 0.254: IC3.22 104.14,91.44 105.41,90.17 JP1.2
EXSEL2
  Bottom 0.254: IC3.23 104.14,93.98 105.41,92.71 JP1.1
GND  (via drill 0.5)
  Bottom 0.254: 53.34,63.5 55.88,60.96 IC5.17 IC5.16
  Bottom 0.813: v153.92,6.35 JP2.5 JP2.4
  other vias: 40.13,92.71 7.11,97.79 107.95,93.98 109.22,93.98 124.46,88.9 125.73,88.9 55.88,12.7 43.18,2.54 81.28,2.54 116.84,2.54 135.89,41.91 151.13,24.13 99.06,68.58 90.17,72.39 60.96,52.07 66.04,58.42 82.55,78.74 113.03,87.63 116.84,83.82 11.43,2.54 13.97,24.13 2.54,25.4 2.54,92.71 30.48,95.25 41.27,92.71 129.54,86.36 130.81,86.36 83.82,69.85 80.01,45.72 105.41,45.97 77.47,50.8 45.72,87.63 82.55,95.25 98.55,91.44 100.33,83.82 113.03,96.52 113.03,95.25 99.06,94.49 111.76,91.19 52.07,39.37 52.07,40.64 57.4,41.66 58.93,41.66 54.36,96.01 66.04,85.09 70.1,85.09 44.96,83.82 61.47,67.31 45.72,66.04 45.72,68.58 85.34,58.67 85.34,56.13 85.34,53.59 100.84,40.64 21.59,6.1 51.82,61.98 39.37,17.78 40.64,21.59 43.18,21.59 27.94,7.62 26.92,18.54 29.84,21.34 10.16,29.21 58.17,56.9 58.17,60.71
  pour Top (isolate 0.305): 0,0 157.48,0 157.48,99.06 0,99.06
  pour Bottom (isolate 0.305): 0,0 157.48,0 157.48,99.06 0,99.06
LCDSEL  (via drill 0.5)
  Top 0.254: v107.95,85.09 118.11,85.09 123.19,80.01 128.27,80.01 130.81,77.47 v130.81,29.21
  Bottom 0.254: IC3.17 105.41,78.74 106.68,80.01 106.68,83.82 v107.95,85.09 | v130.81,29.21 130.81,17.78 78.74,17.78 66.04,30.48 66.04,33.03 LCD1.6
N$1
  Top 0.61: LCD1.15 88.65,37.85 88.9,38.1 R5.1
N$2
  Top 0.254: R4.1 58.42,33.53 LCD1.3
N$3
  Top 0.254: R9.1 SBCRX.A
N$4
  Top 0.254: R10.1 SBCTX.A
N$5
  Top 0.254: R1.2 IC1.2
N$6
  Top 0.254: R3.2 IC1.38
N$7
  Top 0.254: R2.2 IC1.36
N$11
  Top 0.254: X1.1 42.52,71.73 44.45,73.66 IC5.7
N$12
  Bottom 0.254: IC5.6 48.13,76.07 X1.2
N$15
  Top 0.813: J1.4 34.29,8.89 35.56,10.16 USB5V.2
N$16
  Top 0.813: POWER.1 7.62,15.24 17.78,5.08 17.78,2.59 F1.2
N$17
  Top 0.813: USB5V.1 F2.2
PA0
  Bottom 0.254: IC6.2 33.02,50.8 29.21,46.99 16.51,46.99 10.16,53.34 6.35,53.34 PORTA.9
PA1
  Bottom 0.254: IC6.3 33.02,53.34 29.21,49.53 16.51,49.53 11.43,54.61 PORTA.8
PA2
  Bottom 0.254: IC6.4 33.02,55.88 29.21,52.07 16.51,52.07 12.7,55.88 6.35,55.88 PORTA.7
PA3
  Bottom 0.254: IC6.5 33.02,58.42 29.21,54.61 15.24,54.61 12.7,57.15 PORTA.6
PA4
  Bottom 0.254: IC6.6 33.02,60.96 29.21,57.15 15.24,57.15 13.97,58.42 6.35,58.42 PORTA.5
PA5
  Bottom 0.254: IC6.7 33.02,63.5 29.21,59.69 PORTA.4
PA6
  Bottom 0.254: IC6.8 33.02,66.04 31.75,67.31 19.05,67.31 12.7,60.96 6.35,60.96 PORTA.3
PA7
  Bottom 0.254: IC6.9 33.02,68.58 31.75,69.85 12.7,69.85 7.62,64.77 PORTA.2
PB0
  Bottom 0.254: IC6.10 33.02,71.12 31.75,72.39 16.51,72.39 12.7,76.2 6.35,76.2 PORTB.9
PB1
  Bottom 0.254: IC6.11 33.02,73.66 31.75,74.93 16.51,74.93 13.97,77.47 PORTB.8
PB2
  Bottom 0.254: IC6.12 33.02,76.2 31.75,77.47 16.51,77.47 15.24,78.74 6.35,78.74 PORTB.7
PB3
  Bottom 0.254: IC6.13 33.02,78.74 31.75,80.01 PORTB.6
PB4
  Bottom 0.254: IC6.14 33.02,81.28 31.75,82.55 16.51,82.55 15.24,81.28 6.35,81.28 PORTB.5
PB5
  Bottom 0.254: IC6.15 33.02,83.82 31.75,85.09 16.51,85.09 13.97,82.55 PORTB.4
PB6
  Bottom 0.254: IC6.16 33.02,86.36 31.75,87.63 16.51,87.63 12.7,83.82 6.35,83.82 PORTB.3
PB7
  Bottom 0.254: IC6.17 33.02,88.9 31.75,90.17 11.43,90.17 7.62,86.36 PORTB.2
PHI2  (via drill 0.5)
  Top 0.254: v57.15,53.34 v57.15,86.36 55.88,85.09 33.02,85.09 31.75,86.36 IC6.25 | v76.2,48.26 IC1.37
  Bottom 0.254: IC1.37 57.15,48.26 | 57.15,48.26 46.99,38.1 QG1.5 | IC3.1 74.93,96.52 64.77,86.36 IC5.27 v57.15,86.36 | v57.15,53.34 57.15,48.26 | JP2.1 158.75,16.51 152.4,22.86 152.4,34.29 149.86,36.83 137.16,36.83 130.81,43.18 111.76,43.18 107.95,46.99 77.47,46.99 v76.2,48.26
R/!W!  (via drill 0.5)
  Top 0.254: v58.42,62.23 58.42,87.63 v58.42,88.9 IC5.28 66.04,88.9 67.31,87.63 74.93,87.63 76.2,86.36 v76.2,76.2
  Bottom 0.254: v58.42,62.23 64.77,62.23 71.12,55.88 IC1.34 73.66,55.88 74.93,54.61 74.93,39.37 73.66,38.1 67.31,38.1 63.25,34.04 LCD1.5 63.5,33.03 63.5,30.48 77.47,16.51 144.78,16.51 147.32,13.97 JP2.2 | IC3.13 101.6,67.31 93.98,67.31 88.9,72.39 80.01,72.39 v76.2,76.2 | IC6.22 24.13,93.98 25.4,92.71 38.1,92.71 40.64,90.17 57.15,90.17 v58.42,88.9
SBC_CTS  (via drill 0.5)
  Top 0.254: v40.64,24.13 40.64,35.56 53.34,48.26 53.34,64.77 49.53,68.58 IC5.9
  Bottom 0.254: v40.64,24.13 34.29,24.13 26.67,16.51 J1.1
SBC_RTS  (via drill 0.5)
  Top 0.254: IC5.8 49.53,71.12 54.61,66.04 54.61,46.99 41.91,34.29 v41.91,22.86
  Bottom 0.254: v41.91,22.86 41.91,13.97 36.83,8.89 J1.5
SBC_TX  (via drill 0.5)
  Top 0.254: IC5.10 47.24,66.04 45.72,64.52 45.72,60.45 46.48,59.69 50.55,59.69 51.31,58.93 51.31,50.55 38.61,37.85 38.61,23.11 v37.85,22.35 | SBCTX.C J1.2
  Bottom 0.254: v37.85,22.35 35.05,22.35 29.21,16.51 J1.2
SBCRX  (via drill 0.5)
  Top 0.254: v39.37,21.59 39.37,36.58 52.07,49.28 52.07,59.69 50.8,60.96 IC5.12 | SBCRX.C J1.3
  Bottom 0.254: v39.37,21.59 31.75,13.97 J1.3

### Text on the board
tPlace: SamCo's 6502 SBC | EXSEL2 | * | W65C02 | EXSEL1 | 2017-10 | (* From GAL) | * | A15 | A14 | A13 | A12 | A11 | A10 | A9 | A8 | A7 | A6 | A5 | A4 | A3 | A2 | A1 | 65C51 | A0 | GAL22V10 | D7 | 32K RAM | D6 | 65C22 | D5 | D4 | D3 | 32K ROM | D2 | D1 | D0 | !RD | * | !WR | MEMORY MAP | * | !NMI | !IRQ | PHI2 | R/!W | +5V | GND | GND | PC / RTS | PC / RX | PC / TX | +5V | PC / CTS | GND | GND | GRN | BLK | FTDI CABLE
tNames: 5VDC
Drill_legend: Board Name: sbc6502 | Board Size: 6.400in x 3.900in | Drill legend | Date: 1/24/2018 4:03:06 PM | 3.1750 mm / 125.000 mil * 4 hits | 2.8000 mm / 110.236 mil * 4 hits | 1.3208 mm / 52.000 mil * 2 hits | 1.1938 mm / 47.000 mil * 2 hits | 1.1000 mm / 43.307 mil * 30 hits | 1.0160 mm / 40.000 mil * 61 hits | 0.8128 mm / 32.000 mil * 194 hits | 0.5000 mm / 19.685 mil * 121 hits